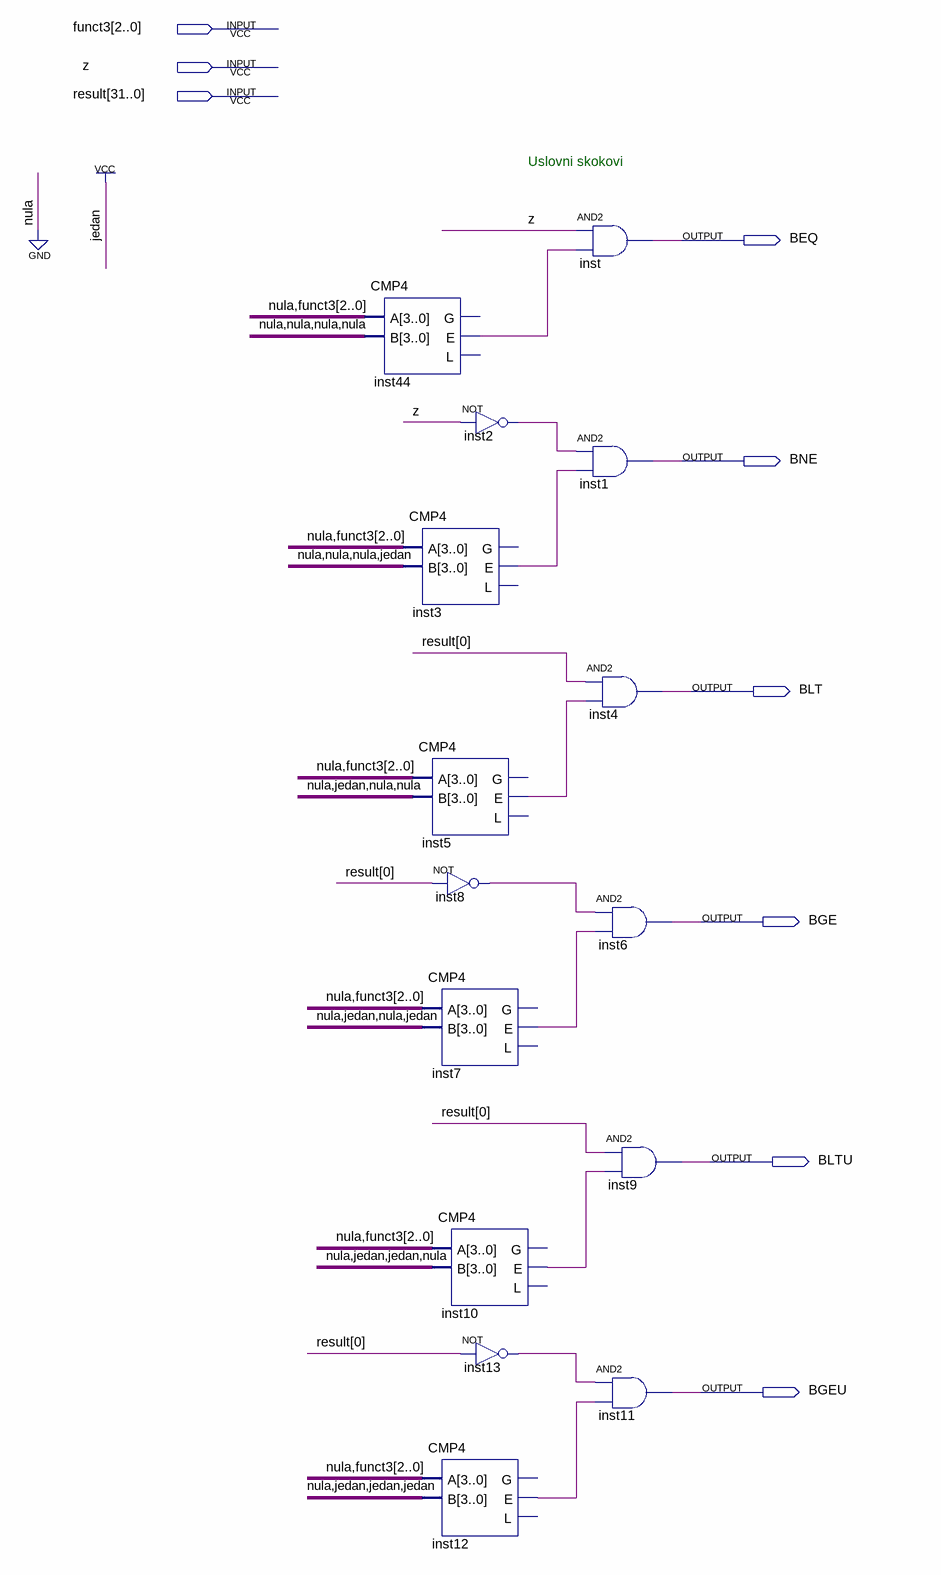
[diagram p0: schematic sheet]
// Quartus schematic BranchDecoder.bdf as structural Verilog: 15 symbols, 9 pins
module BranchDecoder (
  input  [2:0] funct3,
  input  z,
  input  [31:0] result,
  output BEQ,
  output BNE,
  output BLT,
  output BGE,
  output BLTU,
  output BGEU
);

  wire inst2_out, inst3_e, inst5_e, inst7_e, inst8_out, inst10_e, inst12_e, inst13_out, inst44_e;

  CMP4 inst44 (.A({1'b0, funct3}), .B(4'b0000), .E(inst44_e));  // open: G, L
  CMP4 inst3 (.A({1'b0, funct3}), .B(4'b0001), .E(inst3_e));  // open: G, L
  CMP4 inst5 (.A({1'b0, funct3}), .B(4'b0100), .E(inst5_e));  // open: G, L
  not inst8 (inst8_out, result[0]);
  CMP4 inst7 (.A({1'b0, funct3}), .B(4'b0101), .E(inst7_e));  // open: G, L
  CMP4 inst10 (.A({1'b0, funct3}), .B(4'b0110), .E(inst10_e));  // open: G, L
  CMP4 inst12 (.A({1'b0, funct3}), .B(4'b0111), .E(inst12_e));  // open: G, L
  not inst2 (inst2_out, z);
  not inst13 (inst13_out, result[0]);
  and inst (BEQ, z, inst44_e);
  and inst1 (BNE, inst2_out, inst3_e);
  and inst4 (BLT, result[0], inst5_e);
  and inst6 (BGE, inst8_out, inst7_e);
  and inst11 (BGEU, inst13_out, inst12_e);
  and inst9 (BLTU, result[0], inst10_e);

  // Notes on the sheet:
  //   Uslovni skokovi
endmodule
